# EasyEDA Pro project ProDoc_24.4.6功率板_2025-08-03.epro

# Schematic Schematic3
Create Date: 2024-11-27; Page Name: P1; Project Name: 超级电容; Schematic Name: Schematic3; Update Date: 2025-01-22
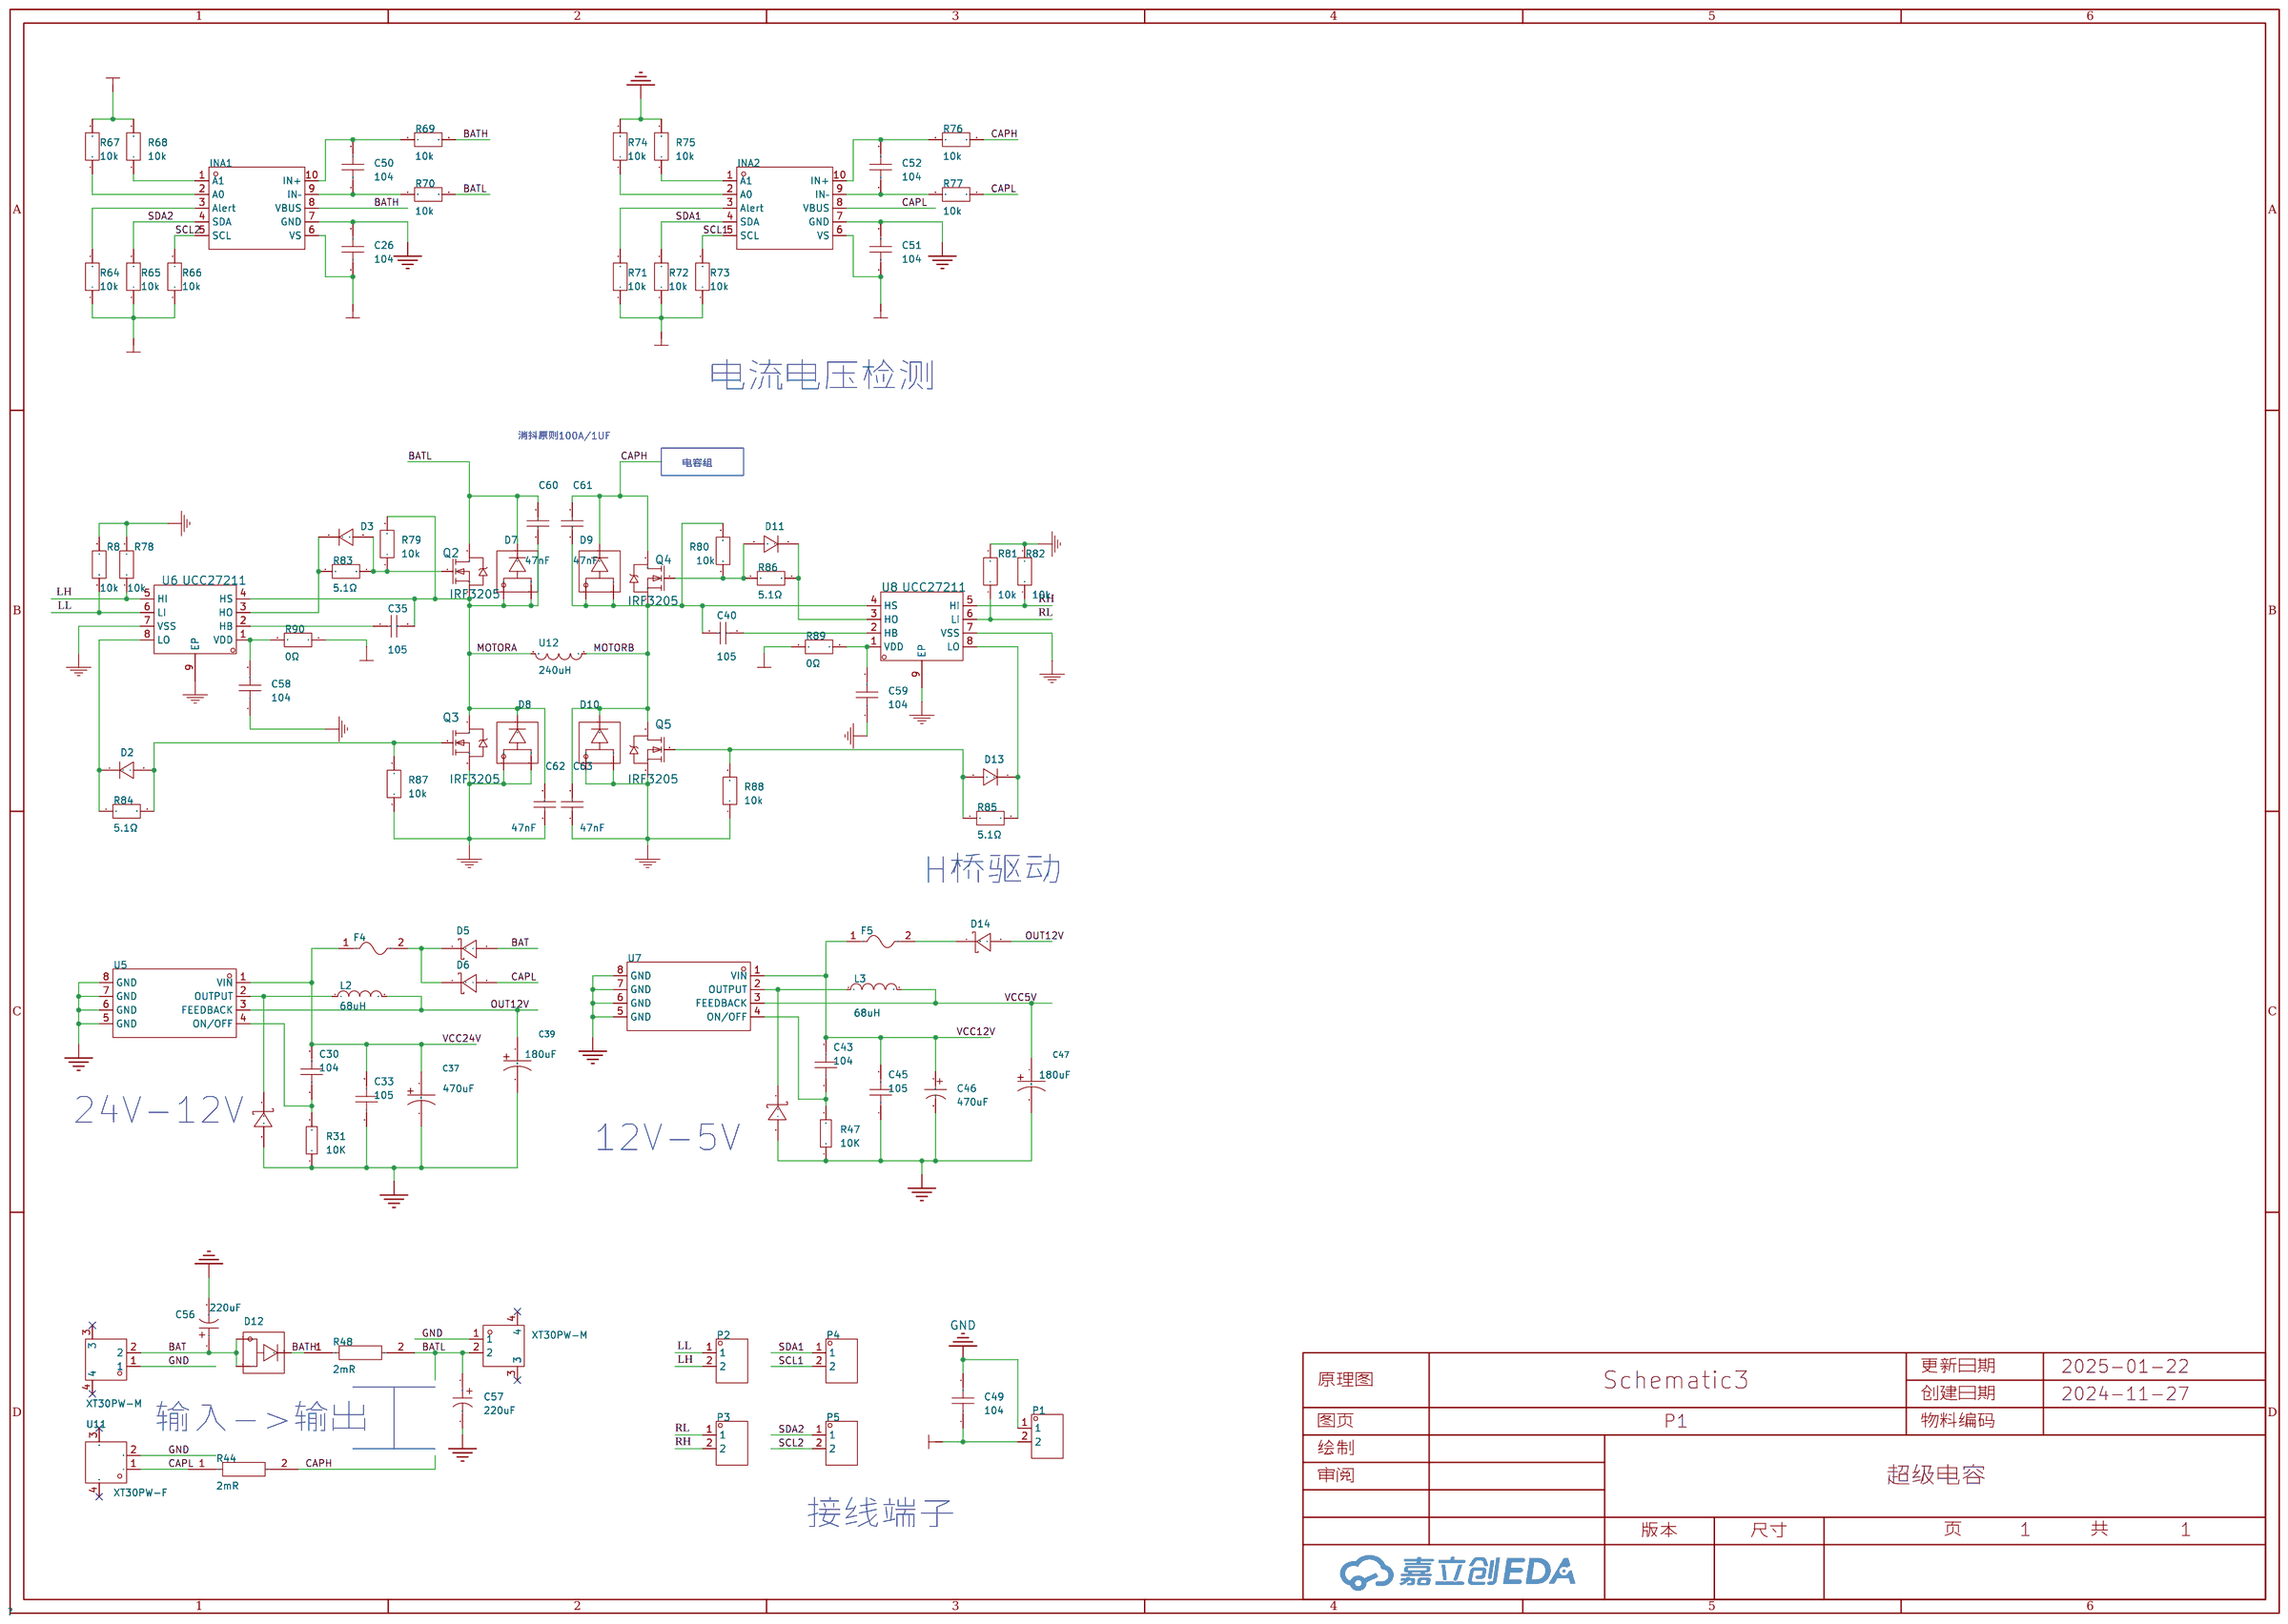
[diagram p0: schematic sheet]

## Parts
C26  104  [C0603]
C30  104  [C0603]
C33  105  [C0603]
C35  105  [C1206]
C37  470uF  [CAP-SMD_BD12.5-L13.0-W13.0-RD]
C39  180uF  [CAP-SMD_BD8.0-L8.3-W8.3-FD]
C40  105  [C1206]
C43  104  [C0603]
C45  105  [C0603]
C46  470uF  [CAP-SMD_BD10.0-L10.3-W10.3-FD]
C47  180uF  [CAP-SMD_BD8.0-L8.3-W8.3-FD]
C49  104  [C0603]
C50  104  [C0603]
C51  104  [C0603]
C52  104  [C0603]
C56  220uF  [CAP-SMD_BD6.3-L6.6-W6.6-FD]
C57  220uF  [CAP-SMD_BD6.3-L6.6-W6.6-FD]
C58  104  [C0603]
C59  104  [C0603]
C60  47nF  [C1206]
C61  47nF  [C1206]
C62  47nF  [C1206]
C63  47nF  [C1206]
CN5  XT30PW-M  [CONN-TH_XT30PW-M]
CN6  XT30PW-M  [CONN-TH_XT30PW-M]
D2  1N4148W  [SOD-123F_L2.7-W1.6-LS3.8-RD]
D3  1N4148W  [SOD-123F_L2.7-W1.6-LS3.8-RD]
D5  SS34K  [SMA_L4.3-W2.6-LS5.2-RD]
D6  SS34K  [SMA_L4.3-W2.6-LS5.2-RD]
D7  PSA2060LT  [PS-277A_L6.3-W4.7-LS7.1-RD]
D8  PSA2060LT  [PS-277A_L6.3-W4.7-LS7.1-RD]
D9  PSA2060LT  [PS-277A_L6.3-W4.7-LS7.1-RD]
D10  PSA2060LT  [PS-277A_L6.3-W4.7-LS7.1-RD]
D11  1N4148W  [SOD-123F_L2.7-W1.6-LS3.8-RD]
D12  PSA2060LT  [PS-277A_L6.3-W4.7-LS7.1-RD]
D13  1N4148W  [SOD-123F_L2.7-W1.6-LS3.8-RD]
D14  SS34K  [SMA_L4.3-W2.6-LS5.2-RD]
F4  nSMD020-30V  [F1206]
F5  nSMD020-30V  [F1206]
INA1  INA226AIDGST  [VSSOP-10_L3.0-W3.0-P0.50-LS4.9-BL]
INA2  INA226AIDGST  [VSSOP-10_L3.0-W3.0-P0.50-LS4.9-BL]
L2  68uH  [IND-SMD_L11.2-W10.0_GPSR1050]
L3  68uH  [IND-SMD_L7.1-W6.6-1]
P1  WJ15EDGRC-3.81-2P  [CONN-TH_2P-P3.81_WJ15EDGRC-3.81-2P]
P2  WJ15EDGRC-3.81-2P  [CONN-TH_2P-P3.81_WJ15EDGRC-3.81-2P]
P3  WJ15EDGRC-3.81-2P  [CONN-TH_2P-P3.81_WJ15EDGRC-3.81-2P]
P4  WJ15EDGRC-3.81-2P  [CONN-TH_2P-P3.81_WJ15EDGRC-3.81-2P]
P5  WJ15EDGRC-3.81-2P  [CONN-TH_2P-P3.81_WJ15EDGRC-3.81-2P]
Q2  IRF3205  [TO-263-3_L10.2-W10.7-P5.08-LS16.2-BR]
Q3  IRF3205  [TO-263-3_L10.2-W10.7-P5.08-LS16.2-BR]
Q4  IRF3205  [TO-263-3_L10.2-W10.7-P5.08-LS16.2-BR]
Q5  IRF3205  [TO-263-3_L10.2-W10.7-P5.08-LS16.2-BR]
R8  10k  [R0603]
R31  10K  [R0603]
R44  2mR  [RES-SMD_L6.4-W3.2-1]
R47  10K  [R0603]
R48  2mR  [RES-SMD_L6.4-W3.2-1]
R64  10k  [R0603]
R65  10k  [R0603]
R66  10k  [R0603]
R67  10k  [R0603]
R68  10k  [R0603]
R69  10k  [R0603]
R70  10k  [R0603]
R71  10k  [R0603]
R72  10k  [R0603]
R73  10k  [R0603]
R74  10k  [R0603]
R75  10k  [R0603]
R76  10k  [R0603]
R77  10k  [R0603]
R78  10k  [R0603]
R79  10k  [R0603]
R80  10k  [R0603]
R81  10k  [R0603]
R82  10k  [R0603]
R83  5.1Ω  [R0603]
R84  5.1Ω  [R0603]
R85  5.1Ω  [R0603]
R86  5.1Ω  [R0603]
R87  10k  [R0603]
R88  10k  [R0603]
R89  0Ω  [R0603]
R90  0Ω  [R0603]
SS2  SS34K  [SMA_L4.3-W2.6-LS5.2-RD]
SS3  SS34K  [SMA_L4.3-W2.6-LS5.2-RD]
U5  XL1509-12  [SOIC-8_L4.9-W3.9-P1.27-LS6.0-BL]
U6  UCC27211  [SOIC-8_L4.9-W3.9-P1.27-LS6.0-BL-EP]
U7  XL1509-12  [SOIC-8_L4.9-W3.9-P1.27-LS6.0-BL]
U8  UCC27211  [SOIC-8_L4.9-W3.9-P1.27-LS6.0-BL-EP]
U11  XT30PW-F  [CONN-TH_XT30PW-F]
U12  240uH  [IND-TH_L10.0-W6.0-P6.00]

## Library data of the parts
C26 C30 C33 C43 C45 C49-C52 C58 C59 = CAP_0603: Supplier Footprint: 0603
C35 C40 C60-C63 = CL31A106KBHNNNE: 容值:10uF;精度:±10%;额定电压:50V;材质(温度系数):X5R;; LCSC Part Name: 10uF ±10% 50V; Supplier Part: C13585; Manufacturer: SAMSUNG(三星); Supplier Footprint: 1206; JLCPCB Part Class: 基础库; Datasheet: https://atta.szlcsc.com/upload/public/pdf/source/20160103/1457707668742.pdf; Supplier: LCSC; Tolerance: ±10%; Voltage Rated: 50V; Temperature Coefficient: X5R
C37 = RVT1H471M1213: 容值:470uF;精度:±20%;额定电压:50V;纹波电流:530mA@120Hz;等效串联电阻:-;; LCSC Part Name: 470uF ±20% 50V; Supplier Part: C90272; Manufacturer: ROQANG(容强); Supplier Footprint: SMD,D12.5xL13.5mm; JLCPCB Part Class: Extended Part; Datasheet: https://atta.szlcsc.com/upload/public/pdf/source/20220809/CF99377A6EA3F4895B6230BA7EE6A383.pdf; Supplier: LCSC; Tolerance: ±20%; Rated Voltage: 50V; φD: 12.5mm; L: 13.5mm; Ripple Current: 530mA@120Hz; Lifetime @ Temp: 2000hrs@105℃; Operating Temperature: -40℃~+105℃
C39 C47 = EEEFK1H181SP: 容值:180uF;精度:±20%;额定电压:50V;电容体直径:8mm;电容体长度:10.2mm;纹波电流:350mA@100kHz;等效串联电阻:340mΩ@100kHz;工作寿命:2000hrs@105℃;工作温度:-55℃~+105℃;; LCSC Part Name: 180uF ±20% 50V; Supplier Part: C413659; Manufacturer: PANASONIC(松下); Supplier Footprint: SMD,8x10.2mm; JLCPCB Part Class: Extended Part; Supplier: LCSC; Tolerance: ±20%; Rated Voltage: 50V; φD: 8mm; L: 10.2mm; Ripple Current: 350mA@100kHz; Equivalent Series Resistance(ESR): 340mΩ@100kHz; Lifetime @ Temp: 2000hrs@105℃; Operating Temperature: -55℃~+105℃
C46 = RVT1E471M1010_C72518: 容值:470uF;精度:±20%;额定电压:25V;纹波电流:286mA@120Hz;等效串联电阻:-;; LCSC Part Name: 470uF ±20% 25V; Supplier Part: C72518; Manufacturer: ROQANG(容强); Manufacturer Part: RVT1E471M1010; Supplier Footprint: SMD,D10xL10.2mm; JLCPCB Part Class: Extended Part; Datasheet: https://atta.szlcsc.com/upload/public/pdf/source/20170325/1490427950282.pdf; Supplier: LCSC; Tolerance: ±20%; Rated Voltage: 25V; φD: 10mm; L: 10.2mm; Ripple Current: 286mA@120Hz; Lifetime @ Temp: 2000hrs@105℃; Operating Temperature: -40℃~+105℃
C56 C57 = RVT220UF16V67RV0015: 容值:220uF;精度:±20%;额定电压:16V;纹波电流:110mA@120Hz;等效串联电阻:-;; LCSC Part Name: 220uF ±20% 16V; Supplier Part: C2887273; Manufacturer: KNSCHA(科尼盛); Supplier Footprint: SMD,D6.3xL7.7mm; JLCPCB Part Class: 扩展库; Datasheet: https://atta.szlcsc.com/upload/public/pdf/source/20210824/3DC9999D9B098FE241E3A26137981C4C.pdf; Supplier: LCSC; Tolerance: ±20%; Rated Voltage: 16V; Ripple Current: 110mA@120Hz; φD: 6.3mm; L: 7.7mm; Lifetime @ Temp: 2000hrs@105℃; Operating Temperature: -55℃~+105℃
CN5 CN6 = XT30PW-M: Socket,DCsupply,XT30,male,PIN:2; LCSC Part Name: AMASS(艾迈斯)航模插头 卧式弯脚 XT30PW-M公头; Supplier Part: C431092; Manufacturer: AMASS(艾迈斯); JLCPCB Part Class: Extended Part; Datasheet: https://atta.szlcsc.com/upload/public/pdf/source/20220222/6A9F22F7850E25B33E1BE430ADF8560B.pdf; Supplier: LCSC
D2 D3 D11 D13 = 1N4148W_C81598: 二极管配置:独立式;功率:400mW;直流反向耐压(Vr):75V;平均整流电流(Io):150mA;正向压降(Vf):1V@50mA;反向恢复时间(trr):4ns;; LCSC Part Name: 75V 150mA 4ns; Supplier Part: C81598; Manufacturer: ST(先科); Supplier Footprint: SOD-123; JLCPCB Part Class: 基础库; Datasheet: https://atta.szlcsc.com/upload/public/pdf/source/20161024/1477288446905.pdf; Supplier: LCSC; Diode Configuration: 独立式; Power Dissipation: 400mW; Reverse Voltage (Vr): 75V; Average Rectified Current (Io): 150mA; Forward Voltage (Vf@If): 1V@50mA; Reverse Leakage Current: 1uA@75V; Reverse Recovery Time (trr): 4ns; Operating Temperature: +150℃@(Tj)
D5 D6 D14 SS2 SS3 = SS34K: 二极管配置:独立式;直流反向耐压(Vr):40V;平均整流电流(Io):3A;正向压降(Vf):550mV@3A;反向电流(Ir):500uA@40V;; LCSC Part Name: 40V 3A 550mV@3A; Supplier Part: C2944425; Manufacturer: TDD(台冠电子); Supplier Footprint: SMA; JLCPCB Part Class: Extended Part; Datasheet: https://atta.szlcsc.com/upload/public/pdf/source/20220223/24F7DC9B6926A710C4F4F20869BDEBCF.pdf; Supplier: LCSC; Diode Configuration: 独立式; Reverse Voltage (Vr): 40V; Average Rectified Current (Io): 3A; Forward Voltage (Vf@If): 550mV@3A; Reverse Leakage Current (Ir): 500uA@40V
D7-D10 D12 = PSA2060LT: 直流反向耐压(Vr):60V;平均整流电流(Io):20A;正向压降(Vf):550mV@20A;; LCSC Part Name: 60V 20A 550mV@20A; Supplier Part: C432756; Manufacturer: PINGWEI(平伟); Supplier Footprint: PS-277A; JLCPCB Part Class: 扩展库; Datasheet: https://atta.szlcsc.com/upload/public/pdf/source/20191125/C432756_36FA46712B99B34BFCACBA2D6DEB3B98.pdf; Supplier: LCSC; Reverse Voltage (Vr): 60V; Average Rectified Current (Io): 20A; Forward Voltage (Vf@If): 550mV@20A
F4 F5 = nSMD020-30V: 最大电压:30V;最大电流:100A;保持电流:200mA;跳闸电流:460mA;; Supplier: LCSC; Manufacturer: 台湾陆海; Supplier Part: C69680; JLCPCB Part Class: Extended Part; LCSC Part Name: 30V 200mA 1206自恢复; Supplier Footprint: 1206; Datasheet: https://atta.szlcsc.com/upload/public/pdf/source/20230404/9F5B471D89C649BCC2835D46521A6324.pdf; Operating Voltage (Max): 30V; Current Rating (Max): 100A; Hold Current: 200mA; Trip Current: 460mA
INA1 INA2 = INA226AIDGST: Supplier Part: C2653870; Manufacturer: TI(德州仪器); Supplier Footprint: VSSOP-10-0.5; JLCPCB Part Class: 扩展库; Datasheet: https://atta.szlcsc.com/upload/public/pdf/source/20230221/D0B383511515CA85C57B3E17F5AC9C0B.pdf; Supplier: LCSC
L2 = GPSR1050-680MS: 类型:一体成型电感;电感值:68uH;精度:±20%;额定电流:-;饱和电流(Isat):-;; LCSC Part Name: 68uH ±20% AEC-Q200 车规级一体成型模压电感 SGTE; Supplier Part: C477371; Manufacturer: Gantong(感通); Supplier Footprint: SMD; JLCPCB Part Class: Extended Part; Supplier: LCSC; Type: 一体成型电感; Tolerance: ±20%; Ratings: AEC-Q200
L3 = PSPMAA0605H-680M-IGF: 电感值:68uH;精度:±20%;额定电流:2A;饱和电流(Isat):2.5A;; LCSC Part Name: 68uH ±20% 2.5A; Supplier Part: C2983094; Manufacturer: PROD(谱罗德); Supplier Footprint: SMD,6.6x7.1mm; JLCPCB Part Class: Extended Part; Datasheet: https://atta.szlcsc.com/upload/public/pdf/source/20220421/FA7B36985F5EDDBED7850D2E38F6BF27.pdf; Supplier: LCSC; Tolerance: ±20%; Rated Current: 2A; Saturation Current (Isat): 2.5A; DC Resistance (DCR): 256mΩ; Ratings: AEC-Q200
P1-P5 = WJ15EDGRC-3.81-2P: 连接器类型:板端/插座-闭口;间距:3.81mm;排数:1;每排PIN数:2;安装方式:弯针;颜色:绿色;; LCSC Part Name: 板端/插座-闭口 3.81mm 排数:1 每排P数:2 弯针; Supplier Part: C8387; Manufacturer: KANGNEX(康奈克斯电气); Supplier Footprint: 弯插,P=3.81mm; JLCPCB Part Class: Extended Part; Datasheet: https://atta.szlcsc.com/upload/public/pdf/source/20191225/C8387_8EBAF10345D2762F0167C8753398EEFA.pdf; Supplier: LCSC; Connector Type: 板端/插座-闭口; Pitch: 3.81mm; Number of Rows: 1; Number of PINs Per Row: 2; Mounting Style: 弯针; Color: 绿色
Q2-Q5 = IRF3205ZSTRLPBF: Supplier: LCSC; Supplier Part: C459959; Manufacturer: InfineonTechnologies; Paste Type: expand; link: https://item.szlcsc.com/409407.html; 3DModel: TO-263-3_L10.2-W8.7-H4.7-LS15.2-P5.08
R8 R64-R90 = AR03BTD1002: 电阻类型:-;阻值:10kΩ;精度:±0.1%;功率:-;温度系数:±50ppm/;最大工作电压:50V;工作温度范围:-55~+125;; LCSC Part Name: 10kΩ ±0.1%; Supplier Part: C2992491; Manufacturer: Viking(光颉); Supplier Footprint: 0603; JLCPCB Part Class: Extended Part; Datasheet: https://atta.szlcsc.com/upload/public/pdf/source/20191129/C465721_10D49275DB41E427863CE9C8D788770A.pdf; Supplier: LCSC; Tolerance: ±0.1%; Temperature Coefficient: ±50ppm/; Overload Voltage (Max): 50V; Operating Temperature Range: -55~+125
R31 R47 = Res_0603: Supplier Footprint: 0603
R44 R48 = LCSR2512FR030Q9L: 电阻类型:采样电阻;阻值:30mΩ;精度:±1%;功率:2W;安装方式:贴片;; LCSC Part Name: 30mΩ ±1% 2W; Supplier Part: C520404; Manufacturer: RESI(开步睿思）; Supplier Footprint: 2512; JLCPCB Part Class: 扩展库; Datasheet: https://atta.szlcsc.com/upload/public/pdf/source/20200421/C494559_0EA5F3F07A5CD3ADEB50CE33EECD32AD.pdf; Supplier: LCSC; Type: 采样电阻; Rated Current: 20A; Tolerance: ±1%; Power(Watts): 2W; Temperature Coefficient: ±50ppm/℃; Mounting Sytle: 贴片
U5 U7 = XL1509-12: Supplier Part: C2889160; Manufacturer: UMW(广东友台半导体); Supplier Footprint: SOIC-8; JLCPCB Part Class: 扩展库; Datasheet: https://atta.szlcsc.com/upload/public/pdf/source/20230412/A4F395BE4384B04485E6C784EB623363.pdf; Supplier: LCSC
U6 U8 = UCC27211: Supplier: LCSC; Supplier Part: C141980; Manufacturer: TexasInstruments; Manufacturer Part: UCC27211DDAR; link: https://lcsc.com/product-detail/DC-DC-Converters_TI_TPS5450DDARG4_TPS5450DDARG4_C7095.html; 3DModel: SOIC-8_L4.9-W3.9-H1.7-LS6.0-P1.27
U11 = XT30PW-F: 类别:-;类型1:-;; LCSC Part Name: AMASS(艾迈斯)电源连接器 母头 XT30PW-F; Supplier Part: C2913282; Manufacturer: AMASS(艾迈斯); JLCPCB Part Class: 扩展库; Datasheet: https://atta.szlcsc.com/upload/public/pdf/source/20190916/C428722_DFF78979486FCB0B58C1FC563067EC88.pdf; Supplier: LCSC; Brand: 艾迈斯; Type: 航模插头; InterfaceType: 母头
U12 = DDGH00000050: 电感值:60uH;精度:±10%;额定电流:-;饱和电流(Isat):-;类型:-;Q值:-;; LCSC Part Name: 60uH ±10%; Supplier Part: C3040857; Manufacturer: 增益; Supplier Footprint: 插件; JLCPCB Part Class: Extended Part; Datasheet: https://atta.szlcsc.com/upload/public/pdf/source/20220729/5AC2C7AF576110DAFA23C153E27C4382.pdf; Supplier: LCSC; Tolerance: ±10%; DC Resistance: 150Ω

## Nets
GND: C26.2 C33.1 C37.2 C39.2 C45.1 C46.2 C47.2 C49.2 C51.2 C56.2 C57.2 C58.1 C59.1 C62.1 C63.1 CN5.1 CN6.1 D8.1 D8.2 D10.1 D10.2 INA1.7(GND) INA2.7(GND) P1.1 Q3.3(S) Q5.3(S) R8.2 R31.1 R47.1 R74.2 R75.2 R78.2 R81.2 R82.2 R87.1 R88.1 SS2.2(A) SS3.2(A) U5.5(GND) U5.6(GND) U5.7(GND) U5.8(GND) U6.7(VSS) U6.9(EP) U7.5(GND) U7.6(GND) U7.7(GND) U7.8(GND) U8.7(VSS) U8.9(EP) U11.2
VCC5V: C26.1 C47.1 C49.1 C51.1 INA1.6(VS) INA2.6(VS) L3.2 P1.2 R67.2 R68.2 U7.3(FEEDBACK)
VCC12V: C43.2 C45.2 C46.1 F5.1 R64.1 R65.1 R66.1 R71.1 R72.1 R73.1 R89.2 R90.1 U7.1(VIN)
VCC24V: C30.2 C33.2 C37.1 F4.1 U5.1(VIN)
BAT: C56.1 CN5.2 D5.2(A) D12.1 D12.2
BATH: D12.3 INA1.8(VBUS) R48.1 R69.2
BATL: C57.1 C60.2 CN6.2 D7.3 Q2.2(D) R48.2 R70.1
CAPH: C61.2 D9.3 Q4.2(D) R44.2 R76.1
CAPL: D6.2(A) INA2.8(VBUS) R44.1 R77.1 U11.1
LH: P2.2 R78.1 U6.5(HI)
LL: P2.1 R8.1 U6.6(LI)
MOTORA: C35.2 C60.1 C62.2 D7.1 D7.2 D8.3 Q2.3(S) Q3.2(D) R79.2 U6.4(HS) U12.2
MOTORB: C40.1 C61.1 C63.2 D9.1 D9.2 D10.3 Q4.3(S) Q5.2(D) R80.2 U8.4(HS) U12.1
OUT12V: C39.1 D14.2(A) L2.2 U5.3(FEEDBACK)
RH: P3.2 R82.1 U8.5(HI)
RL: P3.1 R81.1 U8.6(LI)
SCL1: INA2.5(SCL) P4.2 R73.2
SCL2: INA1.5(SCL) P5.2 R66.2
SDA1: INA2.4(SDA) P4.1 R72.2
SDA2: INA1.4(SDA) P5.1 R65.2
$1N3867: C35.1 U6.2(HB)
$1N3868: D3.2(A) Q2.1(G) R79.1 R83.2
$1N3869: D3.1(K) R83.1 U6.3(HO)
$1N3870: D2.2(A) Q3.1(G) R84.2 R87.2
$1N3871: D2.1(K) R84.1 U6.8(LO)
$1N3876: D13.1(K) R85.2 U8.8(LO)
$1N3877: D13.2(A) Q5.1(G) R85.1 R88.2
$1N3878: D11.1(K) R86.2 U8.3(HO)
$1N3879: D11.2(A) Q4.1(G) R80.1 R86.1
$1N3896: C58.2 R90.2 U6.1(VDD)
$1N3897: C59.2 R89.1 U8.1(VDD)
$1N3898: C40.2 U8.2(HB)
$1N3916: INA1.3(Alert) R64.2
$1N3931: INA2.3(Alert) R71.2
$1N3933: D14.1(C) F5.2
$1N3934: L3.1 SS3.1(C) U7.2(OUTPUT)
$1N3939: C43.1 R47.2 U7.4(ON/OFF)
$1N3967: L2.1 SS2.1(C) U5.2(OUTPUT)
$1N3972: C30.1 R31.2 U5.4(ON/OFF)
$1N3974: D5.1(C) D6.1(C) F4.2
$1N3989: INA1.1(A1) R68.1
$1N3990: INA1.2(A0) R67.1
$1N3991: C50.1 INA1.9(IN–) R70.2
$1N3992: C50.2 INA1.10(IN+) R69.1
$1N3994: INA2.1(A1) R75.1
$1N3995: INA2.2(A0) R74.1
$1N3996: C52.1 INA2.9(IN–) R77.2
$1N3997: C52.2 INA2.10(IN+) R76.2

Not connected (* = marked no-connect by the designer): CN5 3* 4*; CN6 3* 4*; U11 3* 4*

## Notes on the sheet
- 电流电压检测
- 消抖原则100A/1UF
- 电容组
- H桥驱动
- 24V-12V
- 12V-5V
- 输入->输出
- 接线端子

# Board PCB5
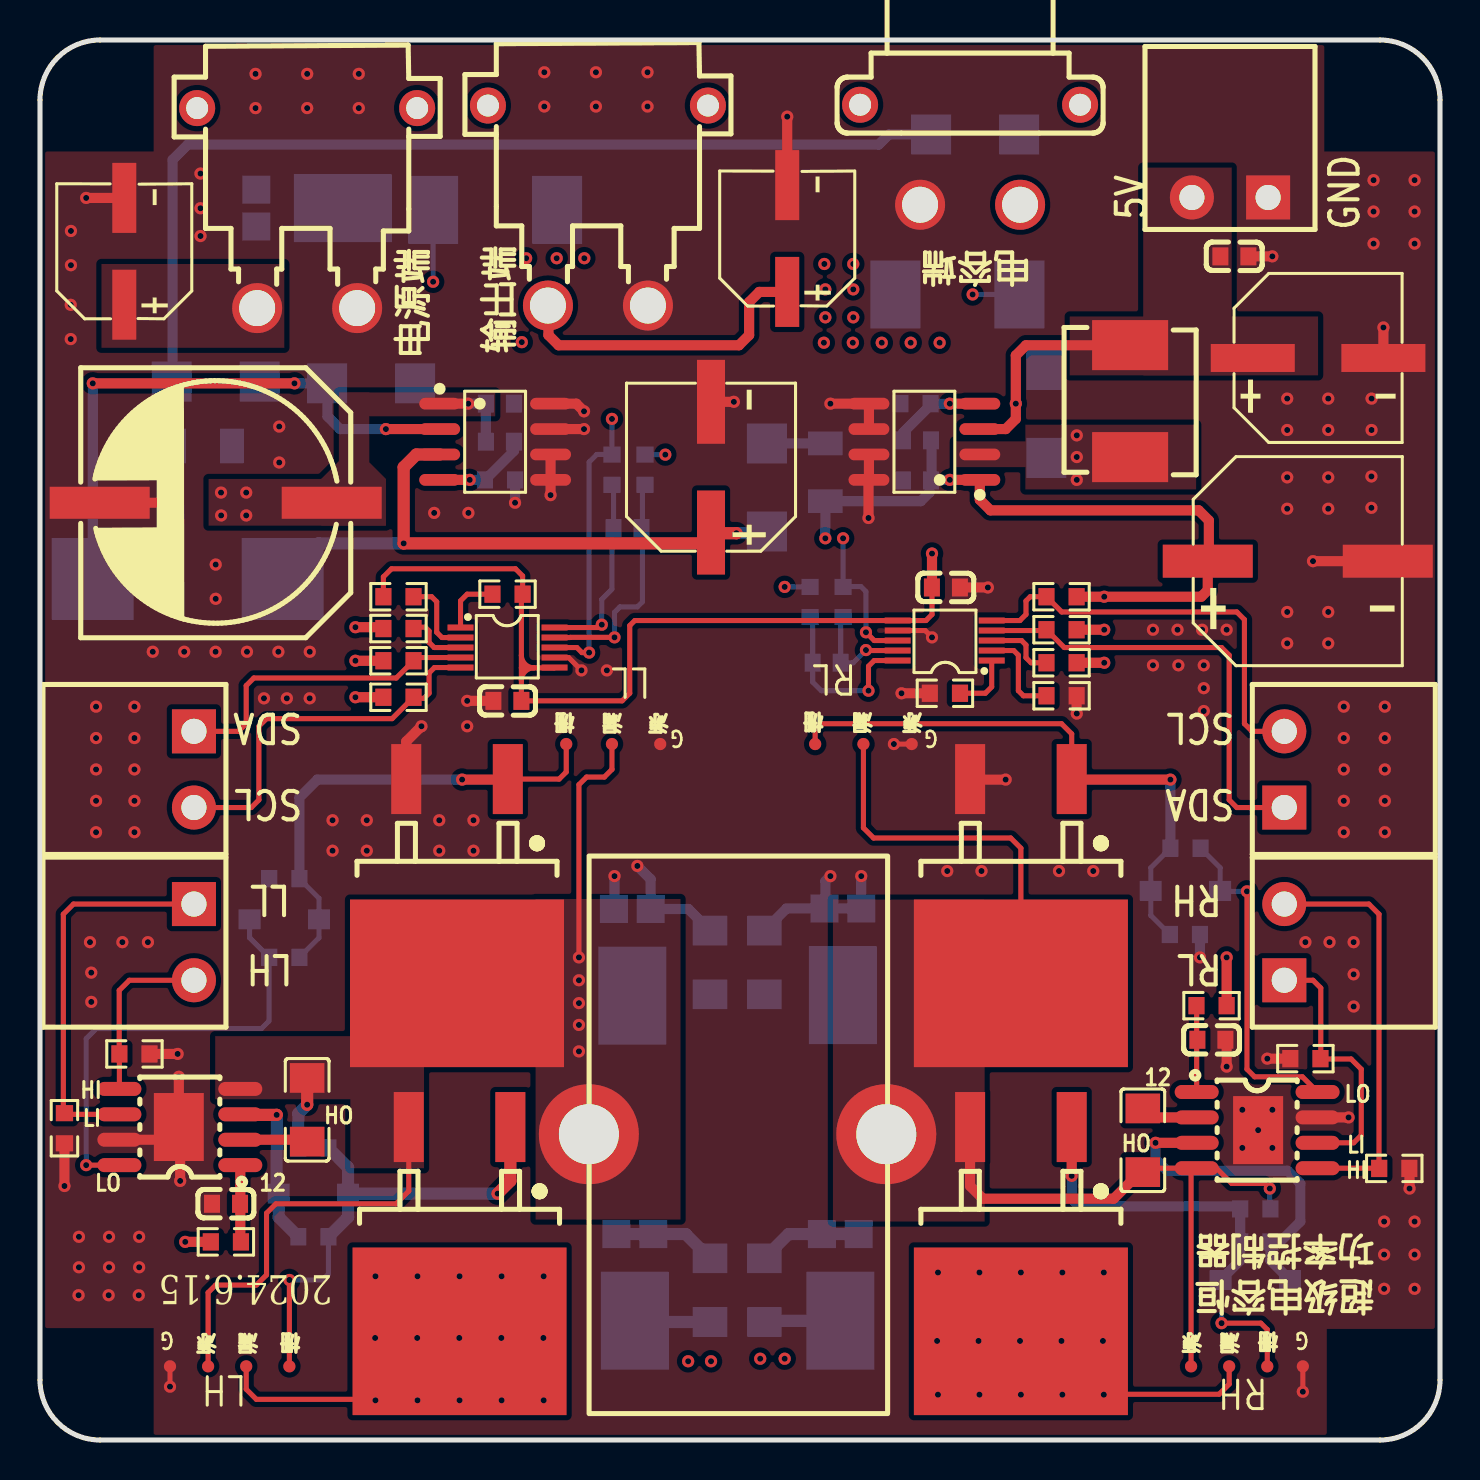
[diagram p1: board, top side]
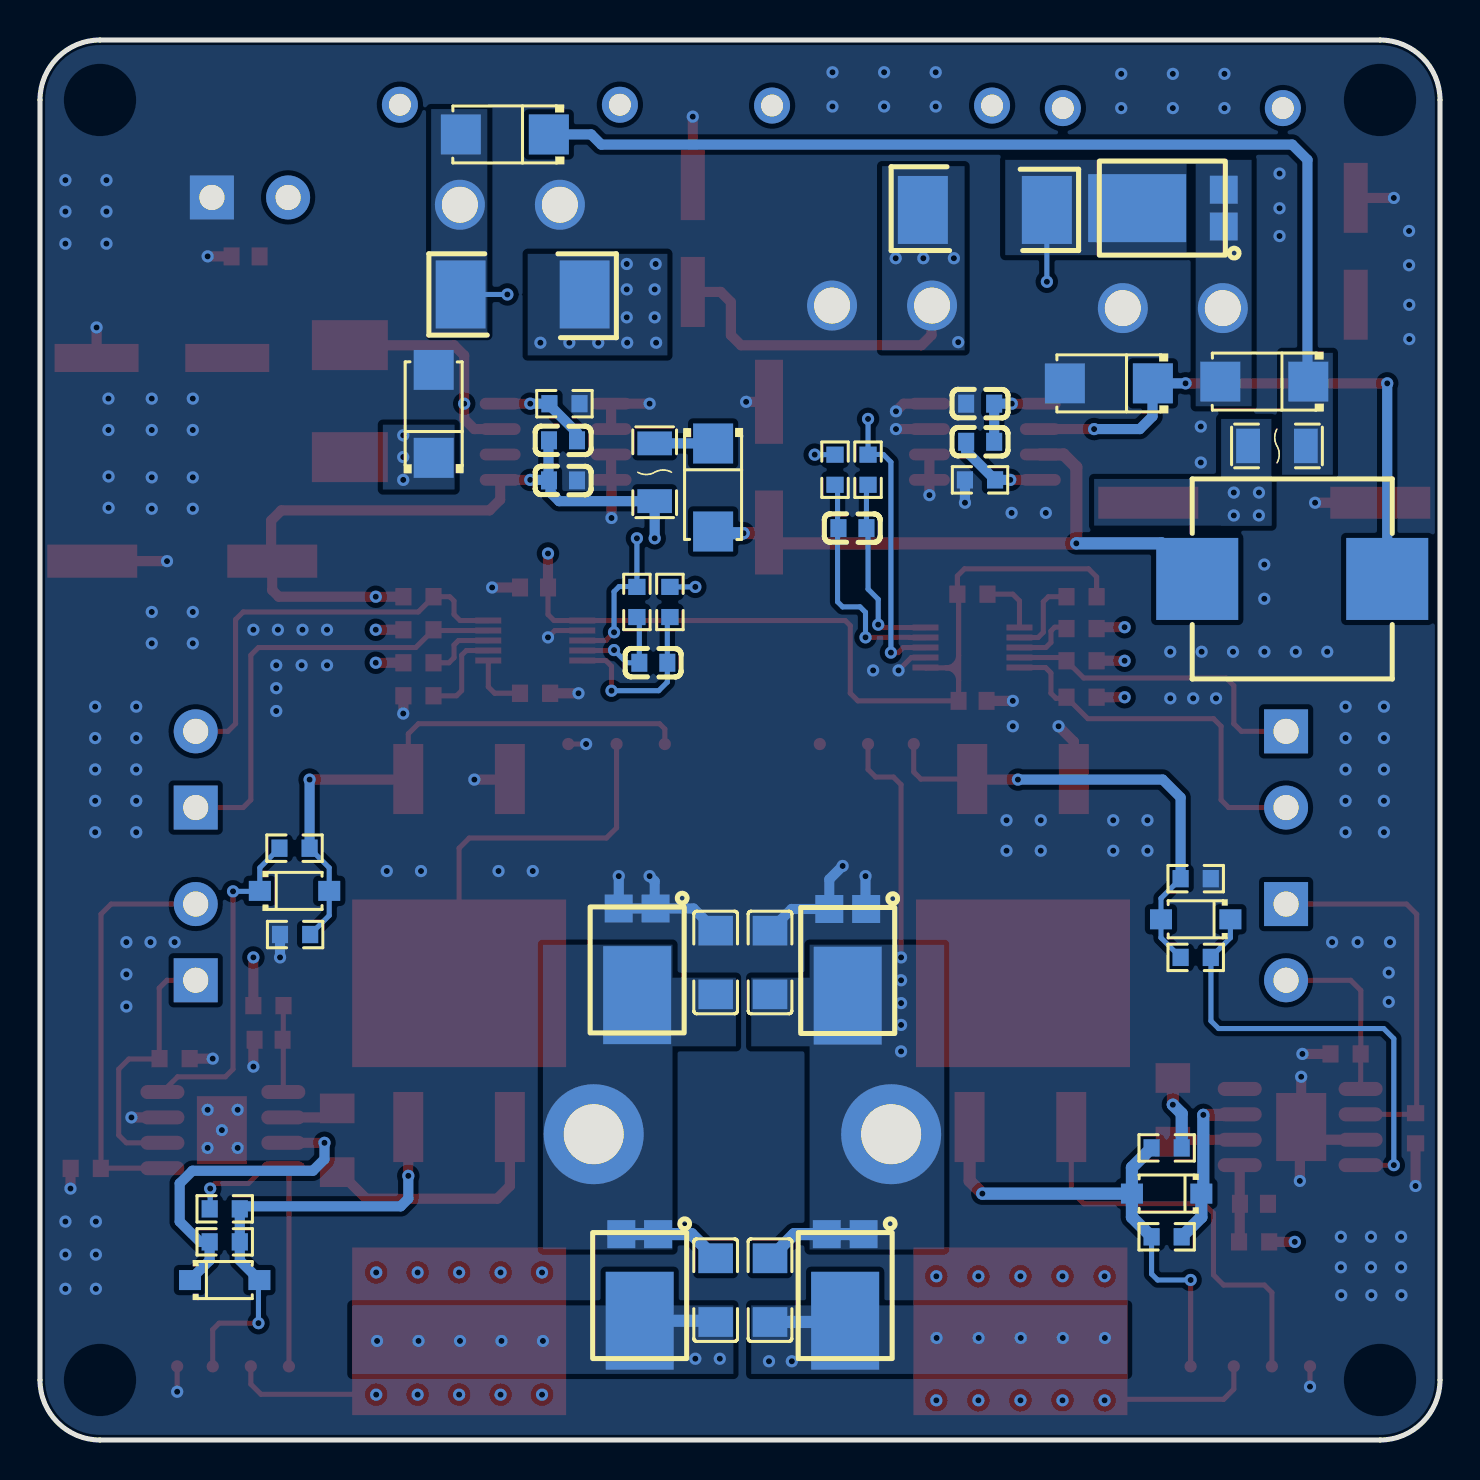
[diagram p2: board, bottom side, seen from below]

Outline 70 x 70 mm; copper layers: Top Layer, Inner1, Inner2, Bottom Layer. Coordinates in mm from the lower left corner of the outline.
Outline path: 0,67 arc(0.88,69.12) 3,70 67,70 arc(69.12,69.12) 70,67 70,3 arc(69.12,0.88) 67,0 3,0 arc(0.88,0.88) 0,3 0,67
Stack: Top Layer 0.035mm 外层铜厚1oz / Dielectric1 0.2104mm 7628 RC49% 8.6mil / Inner1 0.0152mm 内层铜厚 / Dielectric2 1.065mm 1.1mm H/HOZ 含铜 / Inner2 0.0152mm 内层铜厚 / Dielectric3 0.2104mm 7628 RC49% 8.6mil / Bottom Layer 0.035mm 外层铜厚1oz

## Design rules (mm)
template: 自定义配置
spacing copperThickness1oz (default): track to track 0.102, other pairs 0.152 to 0.3
spacing copperThickness2oz: track to track 0.203, other pairs 0.152 to 0.3
track width copperThickness1oz (default): min 0.127, default 0.254, max 2.54
track width copperThickness2oz: min 0.203, default 0.254, max 2.54
differential pair differentialPair (default): width min 0.127, default 0.254, max 2.54; gap min 0.152, default 0.152
via viaSize (default): diameter min 0.5, default 0.61, max 10; hole min 0.3, default 0.305, max 6.3

## Placement (name value [footprint] x y rotation side)
C26  104  [C0603]  23.37 36.96 180 top
C30  104  [C0603]  22.99 49.91 180 bottom
C33  105  [C0603]  22.99 51.82 180 bottom
C35  105  [C1206]  13.36 16.51 90 top
C37  470uF  [CAP-SMD_BD12.5-L13.0-W13.0-RD]  8.79 46.86 0 top
C39  180uF  [CAP-SMD_BD8.0-L8.3-W8.3-FD]  33.55 48.64 90 top
C40  105  [C1206]  55.14 14.99 90 top
C43  104  [C0603]  43.85 49.98 0 bottom
C45  105  [C0603]  43.85 47.98 0 bottom
C46  470uF  [CAP-SMD_BD10.0-L10.3-W10.3-FD]  62.89 43.94 0 top
C47  180uF  [CAP-SMD_BD8.0-L8.3-W8.3-FD]  63.9 54.1 0 top
C49  104  [C0603]  59.72 59.18 0 top
C50  104  [C0603]  29.38 45.59 180 bottom
C51  104  [C0603]  45.3 42.63 0 top
C52  104  [C0603]  39.33 38.86 180 bottom
C56  220uF  [CAP-SMD_BD6.3-L6.6-W6.6-FD]  4.21 59.44 90 top
C57  220uF  [CAP-SMD_BD6.3-L6.6-W6.6-FD]  37.36 60.07 90 top
C58  104  [C0603]  9.3 11.81 0 top
C59  104  [C0603]  58.57 20.01 180 top
C60  47nF  [C1206]  33.5 7.49 270 bottom
C61  47nF  [C1206]  36.22 7.49 270 bottom
C62  47nF  [C1206]  33.5 23.88 270 bottom
C63  47nF  [C1206]  36.22 23.88 270 bottom
CN5  XT30PW-M  [CONN-TH_XT30PW-M]  13.36 61.59 180 top
CN6  XT30PW-M  [CONN-TH_XT30PW-M]  27.9 61.72 180 top
D2  1N4148W  [SOD-123F_L2.7-W1.6-LS3.8-RD]  12.22 26.03 0 bottom
D3  1N4148W  [SOD-123F_L2.7-W1.6-LS3.8-RD]  13.67 12.32 0 bottom
D5  SS34K  [SMA_L4.3-W2.6-LS5.2-RD]  8.79 52.92 0 bottom
D6  SS34K  [SMA_L4.3-W2.6-LS5.2-RD]  46.76 65.28 0 bottom
D7  PSA2060LT  [PS-277A_L6.3-W4.7-LS7.1-RD]  29.74 8.13 90 bottom
D8  PSA2060LT  [PS-277A_L6.3-W4.7-LS7.1-RD]  29.61 24.38 90 bottom
D9  PSA2060LT  [PS-277A_L6.3-W4.7-LS7.1-RD]  40.02 8.13 90 bottom
D10  PSA2060LT  [PS-277A_L6.3-W4.7-LS7.1-RD]  40.14 24.41 90 bottom
D11  1N4148W  [SOD-123F_L2.7-W1.6-LS3.8-RD]  60.76 8 180 bottom
D12  PSA2060LT  [PS-277A_L6.3-W4.7-LS7.1-RD]  12.98 61.59 180 bottom
D13  1N4148W  [SOD-123F_L2.7-W1.6-LS3.8-RD]  57.27 27.46 180 bottom
D14  SS34K  [SMA_L4.3-W2.6-LS5.2-RD]  36.34 47.62 270 bottom
F4  nSMD020-30V  [F1206]  8.15 49.7 180 bottom
F5  nSMD020-30V  [F1206]  39.27 48.39 90 bottom
INA1  INA226AIDGST  [VSSOP-10_L3.0-W3.0-P0.50-LS4.9-BL]  23.38 39.62 270 top
INA2  INA226AIDGST  [VSSOP-10_L3.0-W3.0-P0.50-LS4.9-BL]  45.24 39.97 90 top
L2  68uH  [IND-SMD_L11.2-W10.0_GPSR1050]  7.39 43.05 0 bottom
L3  68uH  [IND-SMD_L7.1-W6.6-1]  54.51 51.94 90 top
NOREF  -  [Pad_e898]  41.17 34.8 180 top
NOREF#2  -  [Pad_e803]  12.47 3.68 180 top
NOREF#3  -  [Pad_e804]  10.31 3.68 180 top
NOREF#4  -  [Pad_e2325]  57.55 3.68 180 top
NOREF#5  -  [Pad_e897]  43.58 34.8 180 top
NOREF#6  -  [Pad_e899]  38.76 34.8 180 top
NOREF#7  -  [Pad_e924]  28.6 34.8 180 top
NOREF#8  -  [Pad_e805]  8.41 3.68 180 top
NOREF#9  -  [Pad_e923]  26.31 34.8 180 top
NOREF#10  -  [Pad_e2321]  61.36 3.68 180 top
NOREF#11  -  [Pad_e925]  31.01 34.8 180 top
NOREF#12  -  [Pad_e889]  63.14 3.68 180 top
NOREF#13  -  [Pad_e2323]  59.46 3.68 180 top
NOREF#14  -  [Pad_e890]  6.5 3.68 180 top
P1  WJ15EDGRC-3.81-2P  [CONN-TH_2P-P3.81_WJ15EDGRC-3.81-2P]  59.5 62.13 180 top
P2  WJ15EDGRC-3.81-2P  [CONN-TH_2P-P3.81_WJ15EDGRC-3.81-2P]  7.7 24.89 270 top
P3  WJ15EDGRC-3.81-2P  [CONN-TH_2P-P3.81_WJ15EDGRC-3.81-2P]  62.21 24.89 90 top
P4  WJ15EDGRC-3.81-2P  [CONN-TH_2P-P3.81_WJ15EDGRC-3.81-2P]  62.21 33.53 90 top
P5  WJ15EDGRC-3.81-2P  [CONN-TH_2P-P3.81_WJ15EDGRC-3.81-2P]  7.7 33.53 270 top
Q2  IRF3205  [TO-263-3_L10.2-W10.7-P5.08-LS16.2-BR]  20.98 10.54 90 top
Q3  IRF3205  [TO-263-3_L10.2-W10.7-P5.08-LS16.2-BR]  20.85 27.94 90 top
Q4  IRF3205  [TO-263-3_L10.2-W10.7-P5.08-LS16.2-BR]  49.05 10.54 90 top
Q5  IRF3205  [TO-263-3_L10.2-W10.7-P5.08-LS16.2-BR]  49.05 27.94 90 top
R8  10k  [R0603]  1.22 15.59 270 top
R31  10K  [R0603]  23 48.01 180 bottom
R44  2mR  [RES-SMD_L6.4-W3.2-1]  45.87 57.28 180 bottom
R47  10K  [R0603]  43.78 51.82 0 bottom
R48  2mR  [RES-SMD_L6.4-W3.2-1]  22.76 61.5 0 bottom
R64  10k  [R0603]  17.92 40.57 0 top
R65  10k  [R0603]  17.92 38.96 0 top
R66  10k  [R0603]  17.92 37.14 0 top
R67  10k  [R0603]  17.92 42.16 180 top
R68  10k  [R0603]  23.38 42.29 0 top
R69  10k  [R0603]  28.6 48.51 90 bottom
R70  10k  [R0603]  30.25 48.51 270 bottom
R71  10k  [R0603]  51.08 38.86 180 top
R72  10k  [R0603]  51.08 40.51 180 top
R73  10k  [R0603]  51.08 42.16 180 top
R74  10k  [R0603]  51.08 37.21 0 top
R75  10k  [R0603]  45.25 37.34 180 top
R76  10k  [R0603]  38.5 41.9 270 bottom
R77  10k  [R0603]  40.16 41.9 270 bottom
R78  10k  [R0603]  4.72 19.3 0 top
R79  10k  [R0603]  13.67 14.6 180 bottom
R80  10k  [R0603]  60.76 11.56 0 bottom
R81  10k  [R0603]  63.27 19.07 180 top
R82  10k  [R0603]  67.71 13.58 0 top
R83  5.1Ω  [R0603]  13.67 10.16 0 bottom
R84  5.1Ω  [R0603]  12.22 24.13 0 bottom
R85  5.1Ω  [R0603]  57.27 29.59 0 bottom
R86  5.1Ω  [R0603]  60.76 9.91 0 bottom
R87  10k  [R0603]  12.22 28.07 0 bottom
R88  10k  [R0603]  57.25 25.27 180 bottom
R89  0Ω  [R0603]  58.58 21.72 0 top
R90  0Ω  [R0603]  9.29 9.91 0 top
SS2  SS34K  [SMA_L4.3-W2.6-LS5.2-RD]  16.56 52.83 0 bottom
SS3  SS34K  [SMA_L4.3-W2.6-LS5.2-RD]  50.31 51.31 90 bottom
U5  XL1509-12  [SOIC-8_L4.9-W3.9-P1.27-LS6.0-BL]  22.76 49.91 270 top
U6  UCC27211  [SOIC-8_L4.9-W3.9-P1.27-LS6.0-BL-EP]  6.99 15.65 90 top
U7  XL1509-12  [SOIC-8_L4.9-W3.9-P1.27-LS6.0-BL]  44.22 49.91 90 top
U8  UCC27211  [SOIC-8_L4.9-W3.9-P1.27-LS6.0-BL-EP]  60.86 15.49 270 top
U11  XT30PW-F  [CONN-TH_XT30PW-F]  46.5 64.26 180 top
U12  240uH  [IND-TH_L10.0-W6.0-P6.00]  34.95 15.29 180 top

## Footprints (pads in the part's own frame, mm; a bottom-side part is the same pattern mirrored in y, then rotated)
C0603
  rect 0.8x0.9 smd: 1(-0.7,0) 2(0.7,0)
C1206
  rect 1.485x1.728 smd: 1(-1.593,0) 2(1.593,0)
CAP-SMD_BD6.3-L6.6-W6.6-FD
  rect 3.5x1.2 smd: 1(-2.67,0) 2(2.67,0)
CAP-SMD_BD8.0-L8.3-W8.3-FD
  rect 4.2x1.4 smd: 1(-3.267,0) 2(3.267,0)
CAP-SMD_BD10.0-L10.3-W10.3-FD
  rect 4.5x1.65 smd: 1(-4.5,0) 2(4.5,0)
CAP-SMD_BD12.5-L13.0-W13.0-RD
  rect 5x1.6 smd: 1(5.8,0) 2(-5.8,0)
CONN-TH_2P-P3.81_WJ15EDGRC-3.81-2P
  rect 2.2x2.2 hole 1.26: 1(-1.905,0)
  round 2.2 hole 1.26: 2(1.905,0)
CONN-TH_XT30PW-F
  round 2.5 hole 1.8: 1(-2.5,2.5) 2(2.5,2.5)
  round 1.8 hole 1.1: 3(5.5,-2.5) 4(-5.5,-2.5)
CONN-TH_XT30PW-M
  round 2.5 hole 1.8: 1(-2.5,5) 2(2.5,5)
  round 1.8 hole 1.1: 3(5.5,-5) 4(-5.5,-5)
F1206
  rect 1.19x1.728 smd: 1(-1.445,0) 2(1.445,0)
IND-SMD_L7.1-W6.6-1
  rect 2.5x3.8 smd: 1(-2.8,0) 2(2.8,0)
IND-SMD_L11.2-W10.0_GPSR1050
  rect 4.1x4.1 smd: 1(-4.75,0) 2(4.75,0)
IND-TH_L10.0-W6.0-P6.00
  round 5 hole 3: 1(-7.366,0) 2(7.505,0)
Pad_e803
  round 0.61 smd: TP1(0,0)
Pad_e804
  round 0.61 smd: TP1(0,0)
Pad_e805
  round 0.61 smd: TP1(0,0)
Pad_e889
  round 0.61 smd: TP1(0,0)
Pad_e890
  round 0.61 smd: TP1(0,0)
Pad_e897
  round 0.61 smd: TP1(0,0)
Pad_e898
  round 0.61 smd: TP1(0,0)
Pad_e899
  round 0.61 smd: TP1(0,0)
Pad_e923
  round 0.61 smd: TP1(0,0)
Pad_e924
  round 0.61 smd: TP1(0,0)
Pad_e925
  round 0.61 smd: TP1(0,0)
Pad_e2321
  round 0.61 smd: TP1(0,0)
Pad_e2323
  round 0.61 smd: TP1(0,0)
Pad_e2325
  round 0.61 smd: TP1(0,0)
PS-277A_L6.3-W4.7-LS7.1-RD
  rect 1.4x1.4 smd: 1(2.166,-0.92) 2(2.166,0.92)
  rect 4.9x3.4 smd: 3(-2.166,0)
R0603
  rect 0.806x0.864 smd: 1(-0.753,0) 2(0.753,0)
RES-SMD_L6.4-W3.2-1
  rect 2.5x3.4 smd: 1(-3.1,0) 2(3.1,0)
SMA_L4.3-W2.6-LS5.2-RD
  rect 2x2 smd: 1(-2.2,0) 2(2.2,0)
SOD-123F_L2.7-W1.6-LS3.8-RD
  rect 1.1x1 smd: 1(-1.735,0) 2(1.735,0)
SOIC-8_L4.9-W3.9-P1.27-LS6.0-BL
  oval 0.588x2.045 smd: 1(-1.905,-2.772) 2(-0.635,-2.772) 3(0.635,-2.772) 4(1.905,-2.772) 5(1.905,2.772) 6(0.635,2.772) 7(-0.635,2.772) 8(-1.905,2.772)
SOIC-8_L4.9-W3.9-P1.27-LS6.0-BL-EP
  oval 0.7x2.2 smd: 1(-1.905,-3.022) 2(-0.635,-3.022) 3(0.635,-3.022) 4(1.905,-3.022) 5(1.905,3.022) 6(0.635,3.022) 7(-0.635,3.022) 8(-1.905,3.022)
  rect 3.4x2.5 smd: 9(0,0.051)
TO-263-3_L10.2-W10.7-P5.08-LS16.2-BR
  rect 3.5x1.5 smd: 1(5.106,-2.54) 3(5.106,2.54)
  rect 8.38x10.7 smd: 2(-5.106,0.001)
VSSOP-10_L3.0-W3.0-P0.50-LS4.9-BL
  rect 0.3x1.3 smd: 1(-1,-2.35) 2(-0.5,-2.35) 3(0,-2.35) 4(0.5,-2.35) 5(1,-2.35) 6(1,2.35) 7(0.5,2.35) 8(0,2.35) 9(-0.5,2.35) 10(-1,2.35)

## Nets
As in the schematic, except:
GND: C26.2 C33.1 C37.2 C39.2 C45.1 C46.2 C47.2 C49.2 C51.2 C56.2 C57.2 C58.1 C59.1 C62.1 C63.1 CN5.1 CN6.1 D8.1 D8.2 D10.1 D10.2 INA1.7 INA2.7 NOREF#5.TP1 NOREF#11.TP1 NOREF#12.TP1 NOREF#14.TP1 P1.1 Q3.3 Q5.3 R8.2 R31.1 R47.1 R74.2 R75.2 R78.2 R81.2 R82.2 R87.1 R88.1 SS2.2 SS3.2 U5.5 U5.6 U5.7 U5.8 U6.7 U6.9 U7.5 U7.6 U7.7 U7.8 U8.7 U8.9 U11.2
BATL: C57.1 C60.2 CN6.2 D7.3 NOREF#3.TP1 Q2.2 R48.2 R70.1
CAPH: C61.2 D9.3 NOREF#13.TP1 Q4.2 R44.2 R76.1
MOTORA: C35.2 C60.1 C62.2 D7.1 D7.2 D8.3 NOREF#7.TP1 NOREF#8.TP1 Q2.3 Q3.2 R79.2 U6.4 U12.2
MOTORB: C40.1 C61.1 C63.2 D9.1 D9.2 D10.3 NOREF.TP1 NOREF#4.TP1 Q4.3 Q5.2 R80.2 U8.4 U12.1
$1N3868: D3.2 NOREF#2.TP1 Q2.1 R79.1 R83.2
$1N3870: D2.2 NOREF#9.TP1 Q3.1 R84.2 R87.2
$1N3877: D13.2 NOREF#6.TP1 Q5.1 R85.1 R88.2
$1N3879: D11.2 NOREF#10.TP1 Q4.1 R80.1 R86.1

Pads without a net: CN5 3 4; CN6 3 4; U11 3 4

## Via types
v1: diameter 0.61, hole 0.305, Top Layer to Bottom Layer, 271 vias

## Routing (per net, layer and track width the routed paths; a pad name or vN(x,y) marks a point on that pad's centre or on a via; arc(x,y) is an arc through that point)
GND: length 80
  Top Layer w0.254: INA2.7 44.26,40.47 v1(44.6,40.13) ; v1(6.5,2.67) NOREF#14.TP1 ; v1(63.14,2.41) NOREF#12.TP1 ; v1(27.07,38.48) 26.43,39.12 INA1.7 ; v1(42.69,34.8) NOREF#5.TP1
  Top Layer w0.508: v1(65.43,16.13) U8.7 ; v1(7.01,12.95) 7.01,15.58 6.94,15.65 ; R81.2 v1(61.36,19.07) ; 6.94,15.65 v1(6.94,18.16) ; 6.94,15.65 6.31,15.01 U6.7 ; C26.2 v1(21.36,36.96) ; v1(19.07,35.69) 18.31,34.92 Q3.3 ; 46.5,33.05 46.53,33.02 v1(48.28,33.02) ; C39.2 v1(34.69,51.91) ; C56.2 4.21,62.1 v1(2.31,62.1) ; R82.2 68.48,13.57 v1(68.48,12.57) ; U7.7 U7.8 41.43,47.98 v1(41.43,46.1) ; C46.2 v1(63.65,43.94) ; U5.7 v1(27.2,50.55) ; v1(51.84,36.32) 51.83,36.33 R74.2 ; C57.2 v1(37.36,66.17) ; R78.2 v1(6.88,19.3) ; v1(59.33,18.67) 59.33,19.95 59.21,20.07 ; v1(27.2,51.44) 26.82,51.82 U5.8 ; R8.2 v1(1.22,12.7) ; C37.2 v1(6.25,46.86) ; R75.2 v1(43.08,37.34) ; C51.2 v1(47.39,42.63) ; C47.2 v1(67.17,55.63) ; U7.6 U7.5 v1(39.52,51.82) ; C49.2 v1(61.62,59.18) ; v1(25.53,47.24) U5.5 U5.6
  Bottom Layer w0.508: R88.1 v1(58,24.13) ; v1(41.06,28.19) D10.2 D10.1 37.33,26.58 C63.1 ; D8.1 28.72,26.58 v1(28.72,28.19) ; v1(39.52,28.19) 39.27,27.94 39.27,26.8 ; v1(29.87,28.7) 30.53,28.04 D8.2 32.42,26.55 C62.1 ; v1(61.36,19.07) 61.36,19.05 ; R31.1 v1(23.75,46.86) ; v1(67.17,55.63) 67.21,55.63
  vias: v1(1.54,56.76) v1(1.54,55.05) v1(1.55,60.45) v1(1.55,58.74) v1(1.93,7.24) v1(1.95,10.16) v1(1.95,8.64) v1(2.5,24.89) v1(2.56,23.37) v1(2.56,21.91) v1(2.8,36.67) v1(2.8,35.1) v1(2.8,33.53) v1(2.8,31.96) v1(2.8,30.39) v1(3.43,7.24) v1(3.45,10.16) v1(3.45,8.64) v1(4.12,24.89) v1(4.72,36.67) v1(4.72,35.1) v1(4.72,33.53) v1(4.72,31.96) v1(4.72,30.39) v1(4.94,7.24) v1(4.96,10.16) v1(4.96,8.64) v1(5.4,24.89) v1(5.64,39.41) v1(7.21,39.41) v1(8.02,63.32) v1(8.02,61.59) v1(8.02,60.2) v1(8.79,43.77) v1(8.79,42.06) v1(8.78,39.41) v1(10.35,39.41) v1(10.78,68.31) v1(10.78,66.59) v1(11.2,37.08) v1(11.92,39.41) v1(11.96,50.67) v1(11.96,48.88) v1(12.34,37.08) v1(13.36,68.31) v1(13.36,66.59) v1(13.49,39.41) v1(13.48,37.08) v1(14.63,30.99) v1(14.63,29.46) v1(15.94,68.31) v1(15.94,66.59) v1(16.34,30.99) v1(16.34,29.46) v1(19.71,46.35) v1(19.96,30.99) v1(19.96,29.46) v1(21.42,46.35) v1(21.36,35.69) v1(21.67,30.99) v1(21.67,29.46) v1(25.21,68.39) v1(25.21,66.67) v1(27.8,68.39) v1(27.8,66.67) v1(28.34,38.48) v1(30.38,68.39) v1(30.38,66.67) v1(45.36,28.45) v1(47.07,28.45) v1(50.95,28.45) v1(52.66,28.45) v1(55.65,40.51) v1(55.65,38.73) v1(56.88,40.51) v1(56.92,38.73) v1(58.1,40.51) v1(58.19,38.73) v1(58.19,37.59) v1(58.19,36.45) v1(59.33,40.51) v1(60.12,16.51) v1(60.12,14.6) v1(60.91,15.49) v1(61.62,16.51) v1(61.62,14.6) v1(62.36,52.07) v1(62.36,50.5) v1(62.36,48.13) v1(62.36,46.56) v1(62.36,41.4) v1(62.36,39.83) v1(63.27,24.89) v1(64.41,52.07) v1(64.41,50.5) v1(64.41,48.13) v1(64.41,46.56) v1(64.41,41.4) v1(64.41,39.83) v1(64.48,24.89) v1(65.19,36.67) v1(65.19,35.1) v1(65.19,33.53) v1(65.19,31.96) v1(65.19,30.39) v1(65.68,24.89) v1(65.68,23.28) v1(65.68,21.67) v1(66.58,52.07) v1(66.58,50.5) v1(66.57,48.18) v1(66.57,46.61) v1(66.68,62.99) v1(66.68,61.42) v1(66.68,59.82) v1(67.21,10.92) v1(67.21,9.27) v1(67.21,7.56) v1(67.24,36.67) v1(67.24,35.1) v1(67.24,33.53) v1(67.24,31.96) v1(67.24,30.39) v1(68.73,62.99) v1(68.73,61.42) v1(68.73,59.82) v1(68.73,10.92) v1(68.73,9.27) v1(68.73,7.56)
VCC5V: length 67.9
  Top Layer w0.254: C51.1 44.6,42.62 44.6,41.27 44.3,40.97 INA2.6 29.74,40.97 29.49,40.72 29.49,37.34 29.11,36.96 C26.1 24.07,37.98 ; 24.07,39.23 24.07,42.23 R68.2 24.13,43.2 23.77,43.56 17.57,43.56 17.17,43.16 R67.2 ; 24.07,39.23 24.07,38.61 ; 24.07,39.23 arc(24.25,38.79) 24.69,38.61 ; 24.07,38.61 24.07,37.98 ; 24.07,38.61 24.69,38.61 ; 24.69,38.61 25.71,38.61 INA1.6 ; 24.69,38.61 arc(24.25,38.42) 24.07,37.98
  Top Layer w0.508: L3.2 54.5,54.74 49.3,54.74 48.79,54.23 v1(48.79,51.82) 48.79,51.05 48.28,50.55 U7.3 ; v1(44.6,44.32) 44.6,42.63 C51.1
  Inner2 w0.508: v1(48.79,51.82) 48.79,44.96 48.16,44.32 v1(44.6,44.32)
VCC12V: length 141.2
  Top Layer w0.508: v1(15.77,40.64) 17.1,40.64 R64.1 ; R66.1 v1(15.77,37.14) ; R65.1 v1(15.77,38.96) ; v1(59.33,24.13) 59.33,21.84 ; v1(53.21,40.51) R72.1 ; v1(53.21,38.86) R71.1 ; v1(45.49,48.01) U7.1 46.99,47.01 47.52,46.48 57.94,46.48 58.44,45.97 58.44,44 C46.1 58.39,42.49 58.06,42.16 v1(53.21,42.16) R73.1 ; v1(7.26,9.91) R90.1
  Inner1 w0.508: v1(53.21,42.16) v1(53.21,40.51) v1(53.21,38.86) 53.21,31.14 53.87,30.48 58.7,30.48 59.33,29.84 v1(59.33,24.13)
  Inner2 w0.508: 15.77,34.67 11.07,34.67 10.31,33.91 10.31,10.54 9.68,9.91 v1(7.26,9.91) ; 15.77,34.67 38.51,34.67 39.27,35.43 v1(39.27,45.08) ; 15.77,34.67 v1(15.77,37.14) v1(15.77,38.96) v1(15.77,40.64)
  Bottom Layer w0.508: 44.58,48.01 44.58,49.96 C43.2 ; 44.58,48.01 v1(45.49,48.01) ; 44.58,48.01 C45.2 44.47,47.9 44.47,47.37 44.04,46.94 F5.1 v1(39.27,45.08)
VCC24V: length 4.2
  Top Layer w0.508: v1(21.41,51.82) U5.1
  Bottom Layer w0.508: v1(21.41,51.82) C33.2 C30.2
  vias: v1(9.05,47.37) v1(9.06,46.23) v1(10.31,47.37) v1(10.31,46.23)
BATH: length 33.1
  Top Layer w0.254: INA1.8 26.84,39.62 27.1,39.37 v1(27.46,39.37)
  Inner2 w0.254: v1(28.6,51.05) 28.6,52.87 28,53.47 20.09,53.47 19.66,53.9 v1(19.66,57.91)
  Bottom Layer w0.254: v1(28.6,51.05) R69.2 ; 28.47,49.27 28.46,49.28 27.84,49.28 27.46,48.89 v1(27.46,39.37) ; R48.1 v1(19.66,57.91)
BATL: length 33.9
  Top Layer w0.254: v1(31.27,49.27) 31.27,49.28 ; Q2.2 17.58,2.03 10.82,2.03 10.31,2.54 NOREF#3.TP1
  Top Layer w0.508: C57.1 35.96,57.4 35.46,56.9 35.46,55.24 34.95,54.74 25.93,54.74 25.42,55.24 25.42,56.7 CN6.2
  Bottom Layer w0.254: R70.1 v1(31.27,49.27)
  Bottom Layer w0.61: D7.3 29.8,5.9 C60.2
  vias: v1(16.77,8.19) v1(16.76,5.1) v1(16.77,1.98) v1(18.88,8.19) v1(18.86,5.1) v1(18.88,1.98) v1(20.98,8.19) v1(20.96,5.1) v1(20.98,1.98) v1(23.08,8.19) v1(23.07,5.1) v1(23.08,1.98) v1(24.09,54.89) v1(24.31,59.09) v1(25.18,8.19) v1(25.17,5.1) v1(25.18,1.98) v1(25.83,59.09) v1(27.22,59.09) v1(32.41,3.94) v1(33.55,3.94)
CAPH: length 17.9
  Top Layer w0.254: Q4.2 52.19,2.29 58.95,2.29 59.46,2.79 NOREF#13.TP1
  Bottom Layer w0.254: R76.1 v1(37.23,42.66)
  Bottom Layer w0.61: D9.3 36.28,5.96 C61.2
  vias: v1(36.01,4.06) v1(37.23,4.06) v1(39.22,58.8) v1(39.19,54.86) v1(39.27,57.53) v1(39.27,56.13) v1(40.66,58.8) v1(40.66,57.53) v1(40.66,56.13) v1(40.64,54.86) v1(42.09,54.86) v1(43.53,54.86) v1(44.9,8.38) v1(44.85,4.95) v1(44.9,2.27) v1(44.98,54.86) v1(46.93,4.95) v1(46.97,8.38) v1(46.97,2.27) v1(49,4.95) v1(49.04,8.38) v1(49.04,2.27) v1(51.12,8.38) v1(51.07,4.95) v1(51.12,2.27) v1(53.19,8.38) v1(53.15,4.95) v1(53.19,2.27)
CAPL: length 28
  Top Layer w0.254: v1(41.3,40.39) 41.71,39.97 INA2.8
  Inner2 w0.254: v1(40.16,45.08) 40.54,45.47 46.25,45.47 46.63,45.85 v1(46.63,57.28)
  Bottom Layer w0.254: v1(41.3,40.39) 41.3,42.42 41.04,42.67 40.17,42.67 R77.1 v1(40.16,45.08) ; R44.1 v1(46.63,57.28)
LH: length 8.9
  Top Layer w0.254: 3.97,17.55 3.97,19.05 3.96,19.06 3.96,22.48 4.47,22.99 P2.2
LL: length 19.5
  Top Layer w0.254: P2.1 1.67,26.8 1.17,26.29 1.17,16.4 R8.1 1.28,16.28 U6.6
MOTORA: length 41.6
  Top Layer w0.254: Q2.3 18.44,12.45 17.8,11.81 11.8,11.81 11.33,11.34 11.33,8.25 10.82,7.75 8.78,7.75 8.41,7.37 NOREF#8.TP1 ; NOREF#7.TP1 28.6,33.53 28.22,33.15 27.33,33.15 26.95,32.77 v1(26.95,24.13)
  Top Layer w0.61: v1(13.36,16.76) C35.2
  Bottom Layer w0.61: C60.1 32.29,10.29 D7.2 28.82,10.29 ; 12.92,14.6 12.92,16.32 v1(13.36,16.76)
  vias: v1(26.95,22.99) v1(26.95,21.84) v1(26.95,20.75) v1(26.95,19.43)
MOTORB: length 54.8
  Top Layer w0.254: NOREF#4.TP1 57.55,13.31 U8.4 ; U8.4 55.21,13.59 55.14,13.52 ; U8.4 58.82,13.59 59.59,12.83 61.24,12.83 v1(61.49,12.57) ; NOREF.TP1 41.17,30.61 41.68,30.1 48.54,30.1 49.05,29.59 Q5.2
  Top Layer w0.508: 46.5,15.65 46.5,12.7 47.14,12.06 53.69,12.06 55.14,13.52
  Bottom Layer w0.254: v1(61.49,12.57) 61.49,11.58 R80.2
  Bottom Layer w0.61: D9.2 D9.1 37.43,10.29 C61.1
OUT12V: length 31.1
  Top Layer w0.61: U5.3 18.82,49.28 18.18,48.64 v1(18.18,44.83) 33.01,44.83 C39.1 33.59,45.34 v1(34.82,45.34)
  Bottom Layer w0.61: v1(34.82,45.34) 36.26,45.34 D14.2 ; v1(18.18,44.83) 13.92,44.83 L2.2
RH: length 20.7
  Top Layer w0.254: 66.95,13.59 R82.1 ; 66.95,13.59 U8.5 ; 66.95,13.59 66.95,26.29 66.44,26.8 P3.2
RL: length 13.4
  Top Layer w0.254: P3.1 63.65,22.99 64.04,22.6 64.04,19.05 ; 64.04,19.05 65.56,19.05 66.06,18.54 66.06,15.24 65.68,14.86 U8.6 ; 64.04,19.05 R81.1
SCL1: length 21.4
  Top Layer w0.254: P4.2 60.6,35.43 60.22,35.81 60.22,41.02 59.84,41.4 51.09,41.4 R73.2 49.51,42.16 49.3,41.95 49.3,41.28 49,40.97 INA2.5
SCL2: length 19
  Top Layer w0.254: INA1.5 19.72,38.62 19.45,38.35 19.45,37.34 19.2,37.08 18.73,37.08 R66.2 17.61,36.07 11.33,36.07 10.95,35.69 10.95,32 10.56,31.62 P5.2
SDA1: length 22.6
  Top Layer w0.254: P4.1 59.84,31.62 59.46,32 59.46,39.24 59.08,39.62 51.21,39.62 R72.2 50.28,40.47 INA2.4
SDA2: length 16
  Top Layer w0.254: INA1.4 18.84,39.12 R65.2 17.81,38.1 10.69,38.1 10.31,37.72 10.31,35.81 9.93,35.43 P5.1
$1N3867: length 3.4
  Top Layer w0.508: 10.02,15.01 13.26,15.01 C35.1
$1N3868: length 24.5
  Top Layer w0.254: NOREF#2.TP1 v1(12.47,8)
  Top Layer w0.61: Q2.1 23.52,12.95 v1(22.88,12.32)
  Bottom Layer w0.254: v1(12.47,8) 14.12,8 14.42,8.3 R83.2
  Bottom Layer w0.61: R79.1 15.4,13.62 D3.2 v1(22.88,12.32) ; 15.4,12.19 15.4,11.14 R83.2
$1N3869: length 8.4
  Top Layer w0.61: 10.02,16.28 10.04,16.26 v1(11.83,16.26)
  Bottom Layer w0.61: 12.92,10.16 11.93,11.14 D3.1 11.83,12.42 v1(11.83,16.26)
$1N3870: length 24.1
  Top Layer w0.254: 26.44,34.8 26.31,34.67 26.31,33.4 25.96,33.05 Q3.1
  Top Layer w0.508: Q3.1 23.36,33.02 v1(21.11,33.02)
  Bottom Layer w0.254: R84.2 13.95,25.11 D2.2 13.95,27.09 R87.2
  Bottom Layer w0.508: R87.2 12.97,32.12 13.87,33.02 v1(21.11,33.02)
$1N3871: length 23
  Top Layer w0.254: v1(2.31,13.74) U6.8
  Bottom Layer w0.254: v1(2.31,13.74) 2.31,20.07 2.82,20.57 11.07,20.57 11.45,20.95 11.45,24.12 R84.1 10.48,25.11 D2.1
$1N3876: length 16.8
  Top Layer w0.254: v1(60.35,27.43) 60.35,18.54 60.73,18.16 63.12,18.16 U8.8
  Bottom Layer w0.254: v1(60.35,27.43) 59.03,27.43 D13.1 59.01,28.61 R85.2
$1N3877: length 29.7
  Top Layer w0.254: NOREF#6.TP1 38.76,35.55 39.02,35.81 51.08,35.81 51.59,35.31 Q5.1
  Top Layer w0.508: v1(56.52,33.02) 51.61,33.02 Q5.1
  Bottom Layer w0.254: R88.2 55.54,26.23 55.54,28.61 R85.1
  Bottom Layer w0.508: R85.1 v1(56.52,33.02)
$1N3878: length 16.8
  Top Layer w0.508: U8.3 v1(55.78,14.86)
  Bottom Layer w0.508: v1(55.78,14.86) 55.78,14.04 56.35,13.46 62.38,13.46 63.02,12.83 63.02,10.92 62,9.91 R86.2 61.52,8.98 D11.1
$1N3879: length 22.6
  Top Layer w0.254: NOREF#10.TP1 61.36,5.52 61.04,5.84 v1(59.08,5.84)
  Top Layer w0.508: Q4.1 v1(51.59,13.21)
  Bottom Layer w0.254: D11.2 59.08,7.95 v1(59.08,5.84)
  Bottom Layer w0.508: v1(51.59,13.21) 51.59,12.06 51.97,11.68 59.88,11.68 R80.1 R86.1 60.01,8.98 D11.2
$1N3896: length 3.8
  Top Layer w0.508: 10,9.91 10.02,9.92 10.02,13.74
$1N3897: length 4.4
  Top Layer w0.254: 57.82,21.84 57.83,21.83 U8.1
$1N3898: length 2.9
  Top Layer w0.508: 55.14,16.71 55.72,16.13 U8.2
$1N3916: length 3.1
  Top Layer w0.254: R64.2 18.74,40.64 19.26,40.64 19.45,40.45 19.45,39.88 19.71,39.62 INA1.3
$1N3931: length 3.6
  Top Layer w0.254: R71.2 49.55,38.86 49.3,39.12 49.3,39.75 49.08,39.97 INA2.3
$1N3933: length 2.9
  Bottom Layer w0.508: D14.1 36.35,49.83 F5.2
$1N3934:
  vias: v1(51.84,50.23) v1(51.84,49.15) v1(51.84,48.01)
$1N3939: length 4.8
  Top Layer w0.508: v1(45.49,51.82) U7.4
  Bottom Layer w0.508: 43.15,49.98 43.15,50.36 44.6,51.82 v1(45.49,51.82)
$1N3967: length 29
  Top Layer w0.508: v1(12.72,52.83) v1(2.64,52.83) ; U5.2 v1(17.3,50.55)
  Bottom Layer w0.508: v1(17.3,50.55) 15.01,50.55 14.37,51.18 14.37,52.81 SS2.1 v1(12.72,52.83) ; L2.1 v1(2.64,52.83)
$1N3972: length 4.8
  Top Layer w0.508: v1(21.49,48.01) U5.4
  Bottom Layer w0.508: C30.1 23.69,49.45 22.25,48.01 R31.2 v1(21.49,48.01)
$1N3974: length 49.6
  Bottom Layer w0.508: D6.1 42.44,65.28 41.93,64.77 7.39,64.77 6.63,64.01 6.63,52.96 D5.1
$1N3989: length 3.1
  Top Layer w0.254: R68.1 21.36,42.29 21.03,41.96 INA1.1
$1N3990: length 4.1
  Top Layer w0.254: R67.1 19.58,42.16 19.84,41.91 19.84,40.39 20.1,40.12 INA1.2
$1N3991: length 11.8
  Top Layer w0.254: v1(28.72,40.13) 26.51,40.13 26.5,40.12 INA1.9
  Bottom Layer w0.254: 30.12,45.55 30.12,41.91 29.87,41.66 29,41.66 28.72,41.38 v1(28.72,40.13) ; 30.12,45.55 C50.1 ; 30.12,45.55 30.12,47.63 R70.2
$1N3992: length 9.9
  Top Layer w0.254: v1(28.09,40.77) 27.95,40.62 INA1.10
  Bottom Layer w0.254: 28.47,47.76 28.66,47.76 28.68,47.74 C50.2 28.6,45.51 28.6,42.55 28.09,42.04 v1(28.09,40.77)
$1N3994: length 3
  Top Layer w0.254: INA2.1 47.59,37.66 47.27,37.34 46,37.34 R75.1
$1N3995: length 4.7
  Top Layer w0.254: R74.1 49.17,37.21 48.92,37.47 48.92,39.24 48.68,39.47 INA2.2
$1N3996: length 5.5
  Top Layer w0.254: INA2.9 41.32,39.47 v1(41.3,39.5)
  Bottom Layer w0.254: v1(41.3,39.5) 40.66,38.86 C52.1 40.03,41.03 40.16,41.15
$1N3997: length 9.1
  Top Layer w0.254: v1(41.43,37.47) 41.43,38.69 41.71,38.97 INA2.10
  Bottom Layer w0.254: v1(41.43,37.47) 39.06,37.47 38.63,37.9 C52.2 38.63,40.89 38.38,41.15

## Copper pours and planes (outline as drawn; the poured copper is in the pictures)
GND on Top Layer: 74.06,-3.81 -4.68,-3.81 -4.68,73.53 74.06,73.53
GND on Bottom Layer: 71.78,-7.62 -1.88,-7.62 -1.88,80.9 71.78,80.9
VCC5V on Top Layer: 55.16,63.62 59.59,63.62 59.59,53.23 55.16,53.23
VCC5V on Top Layer: 51.49,56.18 63.9,56.18 63.9,53.23 51.49,53.23
VCC24V on Top Layer: 14.94,52.38 22.76,52.38 22.76,51.19 14.94,51.19
VCC24V on Top Layer: 8.43,48.05 17.3,48.05 17.3,45.72 8.43,45.72
VCC24V on Top Layer: 14.05,52.38 17.3,52.38 17.3,45.72 14.05,45.72
VCC24V on Bottom Layer: 8.43,51.05 10.95,51.05 10.95,45.72 8.43,45.72
VCC24V on Bottom Layer: 8.43,48.05 17.3,48.05 17.3,45.72 8.43,45.72
BAT on Top Layer: 3.07,58.8 12.22,58.8 12.22,54.61 3.07,54.61
BAT on Bottom Layer: 9.42,64.01 12.22,64.01 12.22,51.69 9.42,51.69
BATH on Bottom Layer: 12.67,64.01 21.74,64.01 21.74,59.24 12.67,59.24
BATL on Bottom Layer: 15.64,6.73 34.44,6.73 34.44,3.3 15.64,3.3
BATL on Bottom Layer: 23.77,63.69 27.9,63.69 27.9,54.48 23.77,54.48
BATL on Inner1: 13.99,63.69 34.19,63.69 34.19,0.51 13.99,0.51
CAPH on Bottom Layer: 38.63,59.31 45.62,59.31 45.62,54.23 38.63,54.23
CAPH on Bottom Layer: 35.33,6.73 54.38,6.73 54.38,3.3 35.33,3.3
CAPH on Inner1: 35.46,59.31 56.16,59.31 56.16,0.51 35.46,0.51
CAPL on Bottom Layer: 47.64,66.55 50.44,66.55 50.44,55.24 47.64,55.24
MOTORA on Top Layer: 24.78,27.05 32.03,27.05 32.03,11.02 24.78,11.02
MOTORA on Top Layer: 8.76,20.19 19.2,20.19 19.2,17.04 8.76,17.04
MOTORA on Top Layer: 15.52,20.16 19.2,20.16 19.2,13.59 15.52,13.59
MOTORA on Bottom Layer: 24.79,24.77 31.52,24.77 31.52,9.53 24.79,9.53
MOTORA on Bottom Layer: 27.84,23.11 34.44,23.11 34.44,19.69 27.84,19.69
MOTORB on Top Layer: 39.65,27.02 47.23,27.02 47.23,10.92 39.65,10.92
MOTORB on Bottom Layer: 38.38,24.77 44.85,24.77 44.85,9.53 38.38,9.53
MOTORB on Bottom Layer: 35.2,23.11 41.81,23.11 41.81,19.69 35.2,19.69
$1N3934 on Top Layer: 45.74,50.77 57.81,50.77 57.81,47.53 45.74,47.53
$1N3934 on Bottom Layer: 49.27,50.76 52.86,50.76 52.86,47.53 49.27,47.53
$1N3974 on Bottom Layer: 5.36,54.36 7.9,54.36 7.9,48.26 5.36,48.26

## Text on the board
Top Silkscreen Layer: G | HI | LI | LO | 12 | HO | LH | LL | RL | RH | SDA | SCL | 5V | GND | 源 | 漏 | 栅 | 超级电容恒 / 功率控制器 | 2024.6.15 | 电容端 | 电源端 | 输出端
